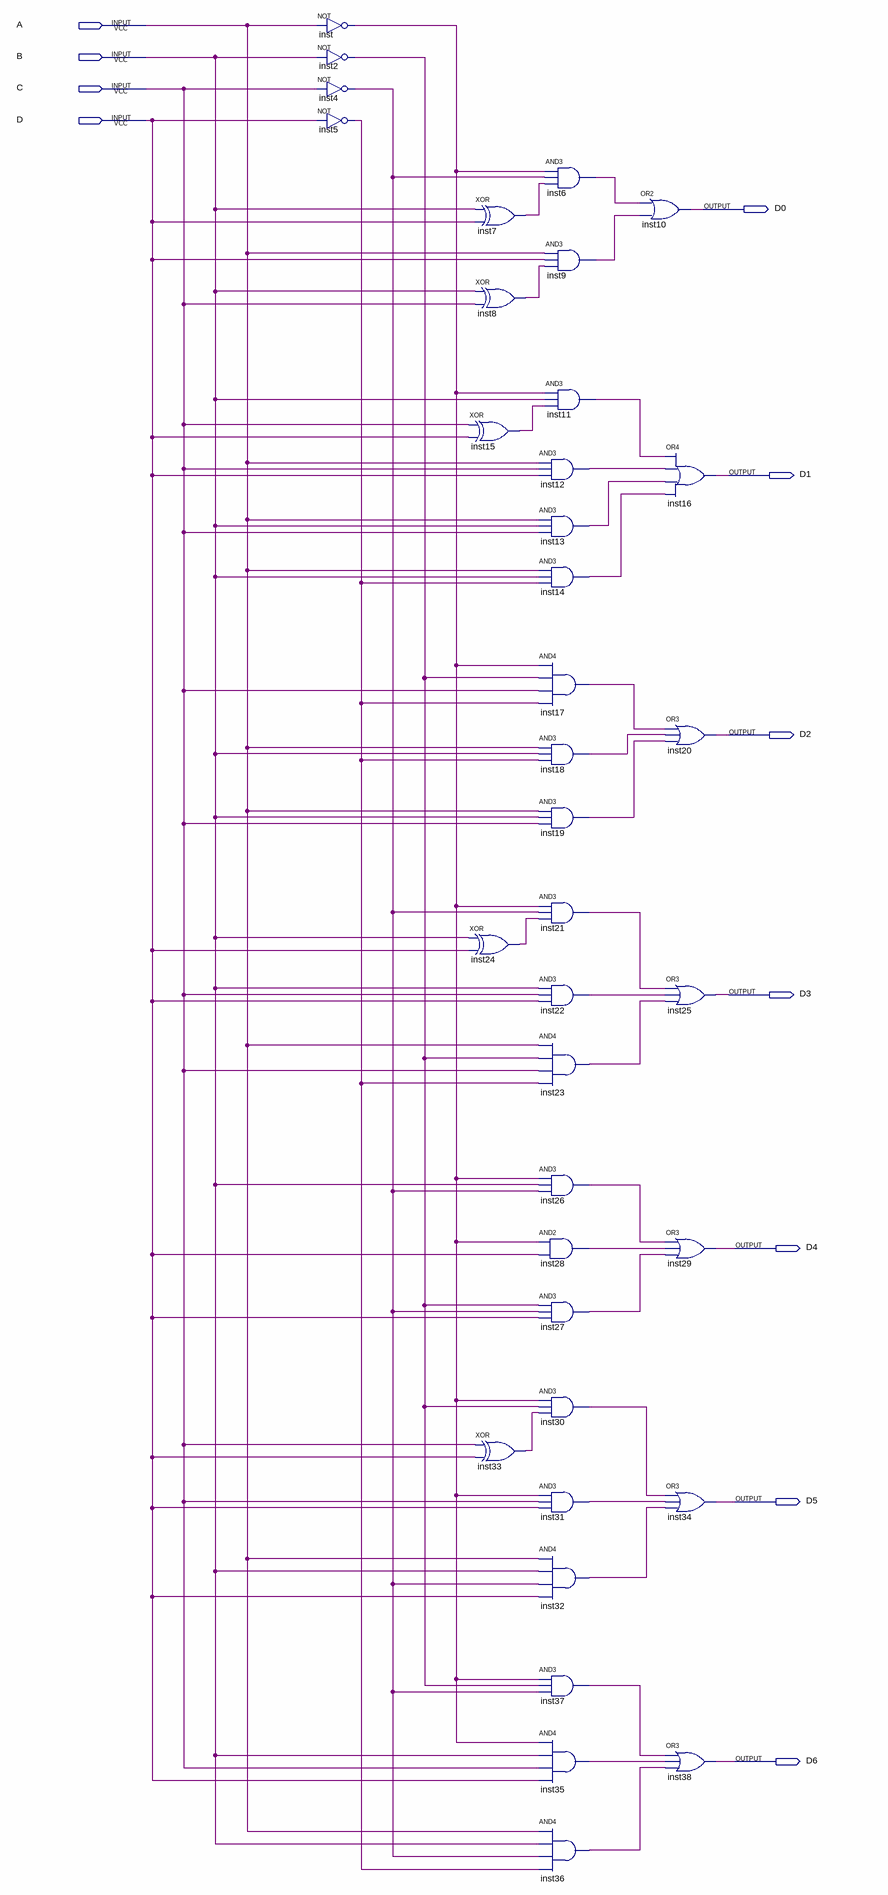
[diagram p0: schematic sheet]
// Quartus schematic 0_esc_circuito_bin27seg.bdf as structural Verilog: 37 symbols, 11 pins
module \0_esc_circuito_bin27seg  (
  input  A,
  input  B,
  input  C,
  input  D,
  output D0,
  output D1,
  output D2,
  output D3,
  output D4,
  output D5,
  output D6
);

  wire inst2_out, inst4_out, inst5_out, inst6_out, inst7_out, inst8_out, inst9_out, inst11_out, inst12_out,
       inst13_out, inst14_out, inst15_out, inst17_out, inst18_out, inst19_out, inst21_out, inst22_out,
       inst23_out, inst24_out, inst26_out, inst27_out, inst28_out, inst30_out, inst31_out, inst32_out,
       inst33_out, inst35_out, inst36_out, inst37_out, inst_out;

  not inst (inst_out, A);
  not inst2 (inst2_out, B);
  not inst4 (inst4_out, C);
  not inst5 (inst5_out, D);
  xor inst7 (inst7_out, B, D);
  xor inst8 (inst8_out, B, C);
  xor inst15 (inst15_out, C, D);
  xor inst24 (inst24_out, B, D);
  xor inst33 (inst33_out, C, D);
  and inst6 (inst6_out, inst_out, inst4_out, inst7_out);
  and inst9 (inst9_out, A, D, inst8_out);
  and inst11 (inst11_out, inst_out, B, inst15_out);
  and inst12 (inst12_out, A, C, D);
  and inst13 (inst13_out, A, B, C);
  and inst14 (inst14_out, A, B, inst5_out);
  and inst17 (inst17_out, inst_out, inst2_out, C, inst5_out);
  and inst18 (inst18_out, A, B, inst5_out);
  and inst19 (inst19_out, A, B, C);
  and inst21 (inst21_out, inst_out, inst4_out, inst24_out);
  and inst22 (inst22_out, B, C, D);
  and inst23 (inst23_out, A, inst2_out, C, inst5_out);
  and inst26 (inst26_out, inst_out, B, inst4_out);
  and inst28 (inst28_out, inst_out, D);
  and inst27 (inst27_out, inst2_out, inst4_out, D);
  and inst30 (inst30_out, inst_out, inst2_out, inst33_out);
  and inst31 (inst31_out, inst_out, C, D);
  and inst32 (inst32_out, A, B, inst4_out, D);
  and inst37 (inst37_out, inst_out, inst2_out, inst4_out);
  and inst35 (inst35_out, inst_out, B, C, D);
  and inst36 (inst36_out, A, B, inst4_out, inst5_out);
  or inst10 (D0, inst6_out, inst9_out);
  or inst16 (D1, inst11_out, inst12_out, inst13_out, inst14_out);
  or inst20 (D2, inst17_out, inst18_out, inst19_out);
  or inst25 (D3, inst21_out, inst22_out, inst23_out);
  or inst29 (D4, inst26_out, inst28_out, inst27_out);
  or inst34 (D5, inst30_out, inst31_out, inst32_out);
  or inst38 (D6, inst37_out, inst35_out, inst36_out);
endmodule
